# EAGLE design CC2-BufferPack-V1R0-21-May-2019 (EAGLE 5.10)

## Sheet 1 of 2
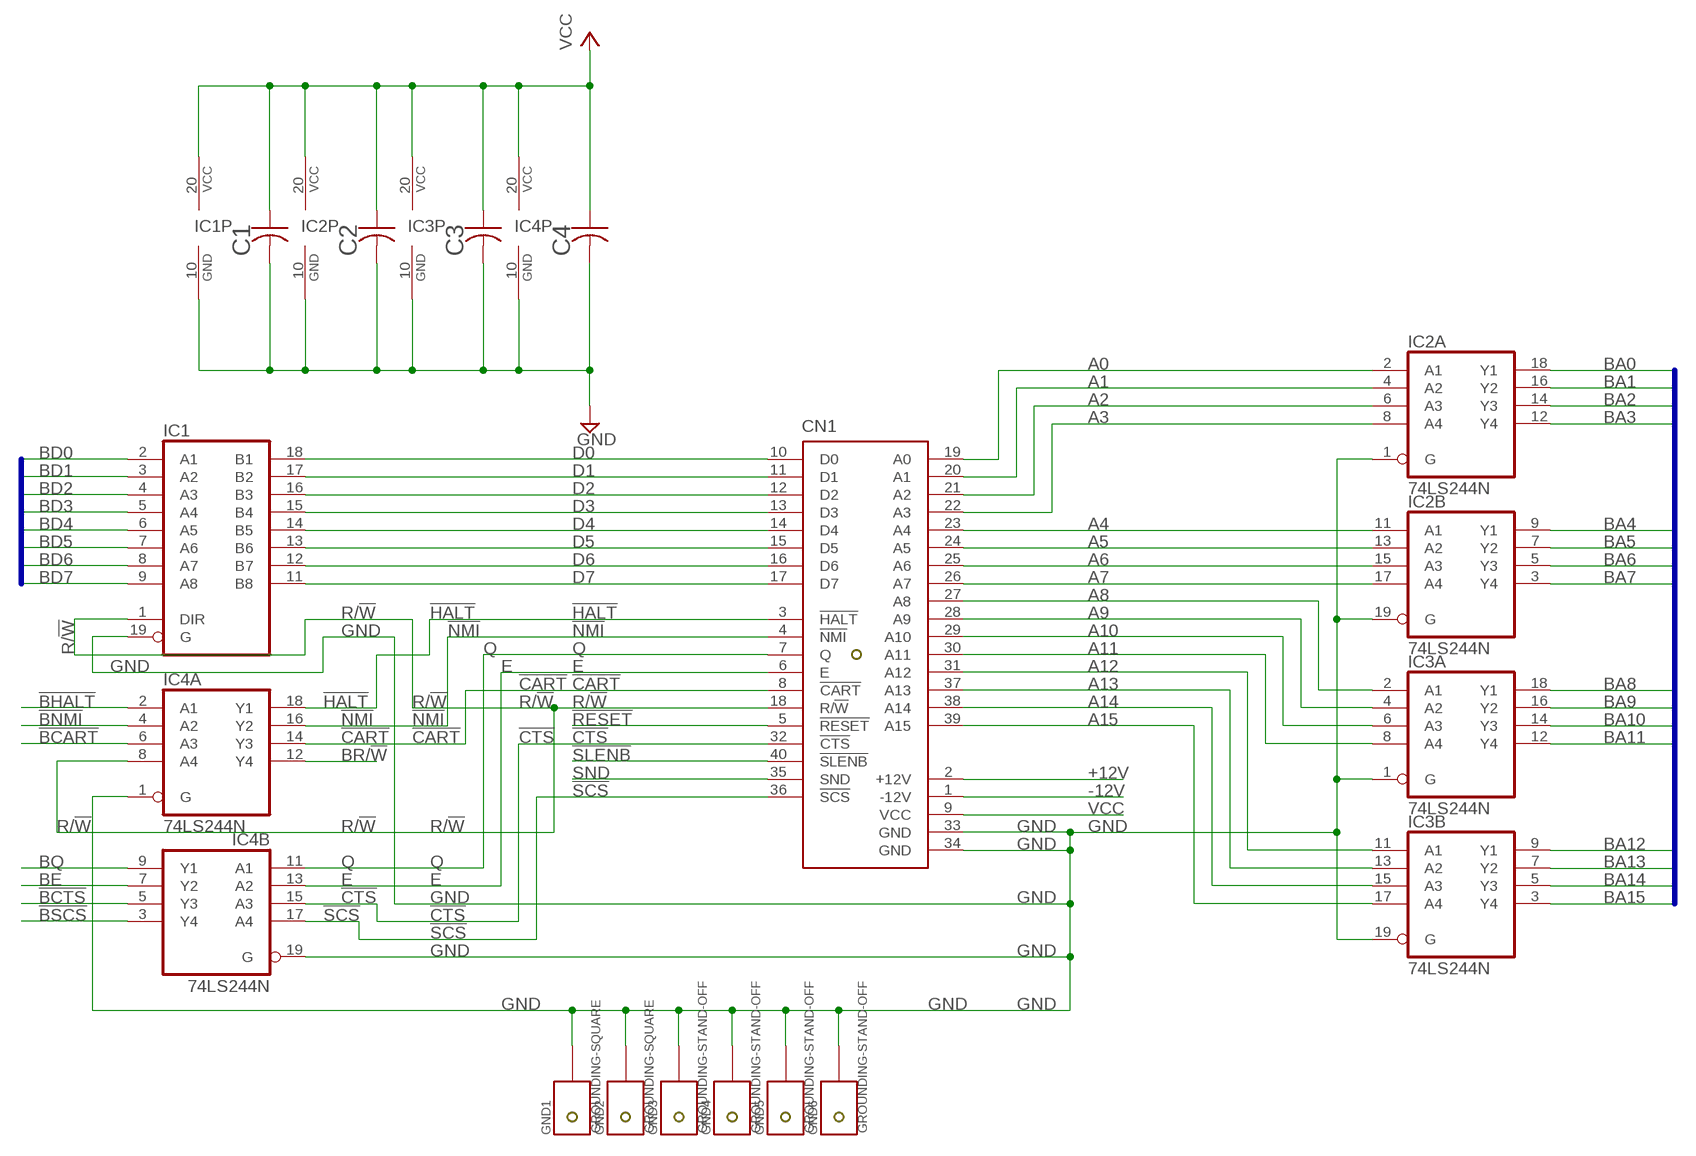
[diagram p0: schematic, sheet 1]

### Parts
C1  CAPACITOR-PTH1  [PTH1]
C2  CAPACITOR-PTH1  [PTH1]
C3  CAPACITOR-PTH1  [PTH1]
C4  CAPACITOR-PTH1  [PTH1]
CN1  COCO3-CARTRIDGE-PLUG-MEDIUM  [EDGE-CARD-PLUG-2X20-100-MEDIUM]
GND1  GROUNDING-SQUARE  [SQUARE]
GND2  GROUNDING-SQUARE  [SQUARE]
GND3  GROUNDING-STAND-OFF  [STAND-OFF]
GND4  GROUNDING-STAND-OFF  [STAND-OFF]
GND5  GROUNDING-STAND-OFF  [STAND-OFF]
GND6  GROUNDING-STAND-OFF  [STAND-OFF]
IC1  74LS245N  [DIL20-3-TOP]
IC2  74LS244N  [DIL20-3-TOP]
IC3  74LS244N  [DIL20-3-TOP]
IC4  74LS244N  [DIL20-3-TOP]

### Nets
!BCART: IC4.6(A:A3) ; also sheet 2
!BCTS: IC4.5(B:Y3) ; also sheet 2
!BHALT: IC4.2(A:A1) ; also sheet 2
!BNMI: IC4.4(A:A2) ; also sheet 2
!BSCS: IC4.3(B:Y4) ; also sheet 2
!CART: CN1.8(!CART) IC4.14(A:Y3)
!CTS: CN1.32(!CTS) IC4.15(B:A3)
!HALT: CN1.3(!HALT) IC4.18(A:Y1)
!NMI: CN1.4(!NMI) IC4.16(A:Y2)
!RESET: CN1.5(!RESET) ; also sheet 2
!SCS: CN1.36(!SCS) IC4.17(B:A4)
!SLENB: CN1.40(!SLENB) ; also sheet 2
+12V [power]: CN1.2(+12V) ; also sheet 2
-12V [power]: CN1.1(-12V) ; also sheet 2
A0: CN1.19(A0) IC2.2(A:A1)
A1: CN1.20(A1) IC2.4(A:A2)
A2: CN1.21(A2) IC2.6(A:A3)
A3: CN1.22(A3) IC2.8(A:A4)
A4: CN1.23(A4) IC2.11(B:A1)
A5: CN1.24(A5) IC2.13(B:A2)
A6: CN1.25(A6) IC2.15(B:A3)
A7: CN1.26(A7) IC2.17(B:A4)
A8: CN1.27(A8) IC3.2(A:A1)
A9: CN1.28(A9) IC3.4(A:A2)
A10: CN1.29(A10) IC3.6(A:A3)
A11: CN1.30(A11) IC3.8(A:A4)
A12: CN1.31(A12) IC3.11(B:A1)
A13: CN1.37(A13) IC3.13(B:A2)
A14: CN1.38(A14) IC3.15(B:A3)
A15: CN1.39(A15) IC3.17(B:A4)
BA0: IC2.18(A:Y1) ; also sheet 2
BA1: IC2.16(A:Y2) ; also sheet 2
BA2: IC2.14(A:Y3) ; also sheet 2
BA3: IC2.12(A:Y4) ; also sheet 2
BA4: IC2.9(B:Y1) ; also sheet 2
BA5: IC2.7(B:Y2) ; also sheet 2
BA6: IC2.5(B:Y3) ; also sheet 2
BA7: IC2.3(B:Y4) ; also sheet 2
BA8: IC3.18(A:Y1) ; also sheet 2
BA9: IC3.16(A:Y2) ; also sheet 2
BA10: IC3.14(A:Y3) ; also sheet 2
BA11: IC3.12(A:Y4) ; also sheet 2
BA12: IC3.9(B:Y1) ; also sheet 2
BA13: IC3.7(B:Y2) ; also sheet 2
BA14: IC3.5(B:Y3) ; also sheet 2
BA15: IC3.3(B:Y4) ; also sheet 2
BD0: IC1.2(A1) ; also sheet 2
BD1: IC1.3(A2) ; also sheet 2
BD2: IC1.4(A3) ; also sheet 2
BD3: IC1.5(A4) ; also sheet 2
BD4: IC1.6(A5) ; also sheet 2
BD5: IC1.7(A6) ; also sheet 2
BD6: IC1.8(A7) ; also sheet 2
BD7: IC1.9(A8) ; also sheet 2
BE: IC4.7(B:Y2) ; also sheet 2
BQ: IC4.9(B:Y1) ; also sheet 2
BR/!W: IC4.12(A:Y4) ; also sheet 2
D0: CN1.10(D0) IC1.18(B1)
D1: CN1.11(D1) IC1.17(B2)
D2: CN1.12(D2) IC1.16(B3)
D3: CN1.13(D3) IC1.15(B4)
D4: CN1.14(D4) IC1.14(B5)
D5: CN1.15(D5) IC1.13(B6)
D6: CN1.16(D6) IC1.12(B7)
D7: CN1.17(D7) IC1.11(B8)
E: CN1.6(E) IC4.13(B:A2)
GND [power]: C1.- C2.- C3.- C4.- CN1.33(GND) CN1.34(GND) GND1.GND GND2.GND GND3.GND GND4.GND GND5.GND GND6.GND IC1.10(GND) IC1.19(G) IC2.1(A:G) IC2.10(P:GND) IC2.19(B:G) IC3.1(A:G) IC3.10(P:GND) IC3.19(B:G) IC4.1(A:G) IC4.10(P:GND) IC4.19(B:G) ; also sheet 2
Q: CN1.7(Q) IC4.11(B:A1)
R/!W: CN1.18(R/!W) IC1.1(DIR) IC4.8(A:A4)
SND: CN1.35(SND) ; also sheet 2
VCC [power]: C1.+ C2.+ C3.+ C4.+ CN1.9(VCC) IC1.20(VCC) IC2.20(P:VCC) IC3.20(P:VCC) IC4.20(P:VCC) ; also sheet 2

### Buses
BD[0..7]
BA[0..15]

## Sheet 2 of 2
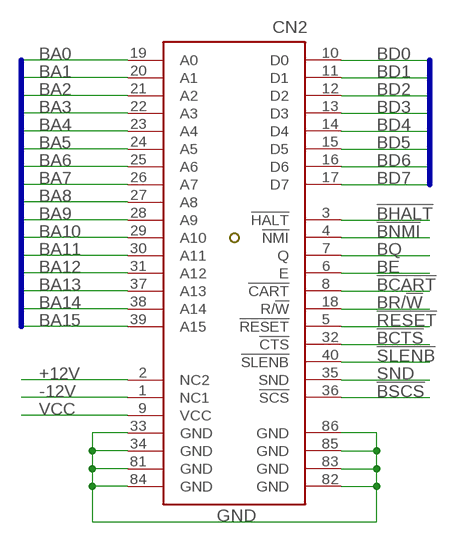
[diagram p1: schematic, sheet 2]

### Parts
CN2  COCO3-CARTRIDGE-SLOT-HEADER/SLOT-40  [HEADER/EDGE-CARD-RECEPTACLE-2X20-100-STRAIGHT-W/EARS]

### Nets
!BCART: CN2.8(!CART) ; also sheet 1
!BCTS: CN2.32(!CTS) ; also sheet 1
!BHALT: CN2.3(!HALT) ; also sheet 1
!BNMI: CN2.4(!NMI) ; also sheet 1
!BSCS: CN2.36(!SCS) ; also sheet 1
!RESET: CN2.5(!RESET) ; also sheet 1
!SLENB: CN2.40(!SLENB) ; also sheet 1
+12V [power]: CN2.2(NC2) ; also sheet 1
-12V [power]: CN2.1(NC1) ; also sheet 1
BA0: CN2.19(A0) ; also sheet 1
BA1: CN2.20(A1) ; also sheet 1
BA2: CN2.21(A2) ; also sheet 1
BA3: CN2.22(A3) ; also sheet 1
BA4: CN2.23(A4) ; also sheet 1
BA5: CN2.24(A5) ; also sheet 1
BA6: CN2.25(A6) ; also sheet 1
BA7: CN2.26(A7) ; also sheet 1
BA8: CN2.27(A8) ; also sheet 1
BA9: CN2.28(A9) ; also sheet 1
BA10: CN2.29(A10) ; also sheet 1
BA11: CN2.30(A11) ; also sheet 1
BA12: CN2.31(A12) ; also sheet 1
BA13: CN2.37(A13) ; also sheet 1
BA14: CN2.38(A14) ; also sheet 1
BA15: CN2.39(A15) ; also sheet 1
BD0: CN2.10(D0) ; also sheet 1
BD1: CN2.11(D1) ; also sheet 1
BD2: CN2.12(D2) ; also sheet 1
BD3: CN2.13(D3) ; also sheet 1
BD4: CN2.14(D4) ; also sheet 1
BD5: CN2.15(D5) ; also sheet 1
BD6: CN2.16(D6) ; also sheet 1
BD7: CN2.17(D7) ; also sheet 1
BE: CN2.6(E) ; also sheet 1
BQ: CN2.7(Q) ; also sheet 1
BR/!W: CN2.18(R/!W) ; also sheet 1
GND [power]: CN2.33(GND) CN2.34(GND) CN2.81(GND) CN2.82(GND) CN2.83(GND) CN2.84(GND) CN2.85(GND) CN2.86(GND) ; also sheet 1
SND: CN2.35(SND) ; also sheet 1
VCC [power]: CN2.9(VCC) ; also sheet 1

### Buses
BA[0..15]
BD[0..7]

## Library data of the parts
C1-C4 = CC2-BufferPack-V1R0-21-May-2019:CAPACITOR: NON-POLARIZED CAPACITOR grid 5mm
CN1 = CC2-BufferPack-V1R0-21-May-2019:COCO3-CARTRIDGE-PLUG: CoCo 3 Program Pak Cartridge Plug - http://www.GIMEchip.com/ Tandy Radio Shack TRS-80 Color Computer 3 Program Pak Cartridge Plug (Edge-Card) E.A.G.L.E. Library Part created by John Eric Turner & His Father - sales@gimechip.com <mailto:sales@gimechip.com?subject=Tandy Radio Shack TRS- 80 Color Computer 3 Program Pak Cartridge Plug (Edge-Card) E.A.G.L.E. Library Part> 40-Pin Edge-Card sharing the same pinout as the Program Pak Cartridge Edge-Card Connector. This library part has been designed to provide a 40-pin cartridge plug connector matching the CoCo's Edge-Card connector (Cartridge Slot). This library part is also useful with the Dragon and other CoCo clones. It is important to note that the CoCo 2 & 3 only provide +5V at the cartridge connector. The CoCo 1 provides +5V AND +/-12V at the cartridge connector. The Dragon provides only +5V and +12V at the cartridge connector. The table below lists all similarities and differences between these machines, relevant to the cartridge slot: PIN # TRS-80 "CoCo 1" Function Tano/Dragon Data "Dragon 32/64" Function TRS-80 "CoCo 2 & 3" Function 1 -12V +12V NC 2 +12V +12V NC 3 HALT* HALT* HALT* 4 NMI* NMI* NMI* 5 RESET* RESET* RESET* 6 E E E 7 Q Q Q 8 CART* CART* CART* 9 +5V +5V +5V 10 D0 D0 D0 11 D1 D1 D1 12 D2 D2 D2 13 D3 D3 D3 14 D4 D4 D4 15 D5 D5 D5 16 D6 D6 D6 17 D7 D7 D7 18 R/W* R/W* R/W* 19 A0 A0 A0 20 A1 A1 A1 21 A2 A2 A2 22 A3 A3 A3 23 A4 A4 A4 24 A5 A5 A5 25 A6 A6 A6 26 A7 A7 A7 27 A8 A8 A8 28 A9 A9 A9 29 A10 A10 A10 30 A11 A11 A11 31 A12 A12 A12 32 CTS* CSEL* CTS* 33 GND GND GND 34 GND GND GND 35 SND SND SND 36 SCS* P2* SCS* 37 A13 A13 A13 38 A14 A14 A14 39 A15 A15 A15 40 SLENB* DSD* SLENB*
CN2 = CC2-BufferPack-V1R0-21-May-2019:COCO3-CARTRIDGE-SLOT: CoCo 3 Program Pak Cartridge Slot HEADER/SLOT - http://www.GIMEchip.com/ Tandy Radio Shack TRS-80 Color Computer 3 Program Pak Cartridge Slot HEADER/SLOT E.A.G.L.E. Library Part created by John Eric Turner & His Father - sales@gimechip.com <mailto:sales@gimechip.com?subject=Tandy Radio Shack TRS- 80 Color Computer 3 Program Pak Cartridge Slot E.A.G.L.E. Library Part> 40-Pin Header and Slot sharing the same pinout as the Program Pak Cartridge Edge-Card Connector. This library part has been designed to provide a 40-pin cartridge slot connector matching the CoCo's Edge-Card connector (Cartridge Slot). This library part is also useful with the Dragon and other CoCo clones. It is important to note that the CoCo 2 & 3 only provide +5V at the cartridge connector. The CoCo 1 provides +5V AND +/-12V at the cartridge connector. The Dragon provides only +5V and +12V at the cartridge connector. The table below lists all similarities and differences between these machines, relevant to the cartridge slot: PIN # TRS-80 "CoCo 1" Function Tano/Dragon Data "Dragon 32/64" Function TRS-80 "CoCo 2 & 3" Function 1 -12V +12V NC 2 +12V +12V NC 3 HALT* HALT* HALT* 4 NMI* NMI* NMI* 5 RESET* RESET* RESET* 6 E E E 7 Q Q Q 8 CART* CART* CART* 9 +5V +5V +5V 10 D0 D0 D0 11 D1 D1 D1 12 D2 D2 D2 13 D3 D3 D3 14 D4 D4 D4 15 D5 D5 D5 16 D6 D6 D6 17 D7 D7 D7 18 R/W* R/W* R/W* 19 A0 A0 A0 20 A1 A1 A1 21 A2 A2 A2 22 A3 A3 A3 23 A4 A4 A4 24 A5 A5 A5 25 A6 A6 A6 26 A7 A7 A7 27 A8 A8 A8 28 A9 A9 A9 29 A10 A10 A10 30 A11 A11 A11 31 A12 A12 A12 32 CTS* CSEL* CTS* 33 GND GND GND 34 GND GND GND 35 SND SND SND 36 SCS* P2* SCS* 37 A13 A13 A13 38 A14 A14 A14 39 A15 A15 A15 40 SLENB* DSD* SLENB*
GND1-GND6 = CC2-BufferPack-V1R0-21-May-2019:GROUNDING
IC1 = CC2-BufferPack-V1R0-21-May-2019:74*245: Octal BUS TRANSCEIVER, 3-state
IC2-IC4 = CC2-BufferPack-V1R0-21-May-2019:74*244: Octal BUFFER and LINE DRIVER, 3-state

## Net classes
0 default: width 0.152 mm, clearance 0.152 mm
1 power: width 0.635 mm, clearance 0.152 mm

## Board
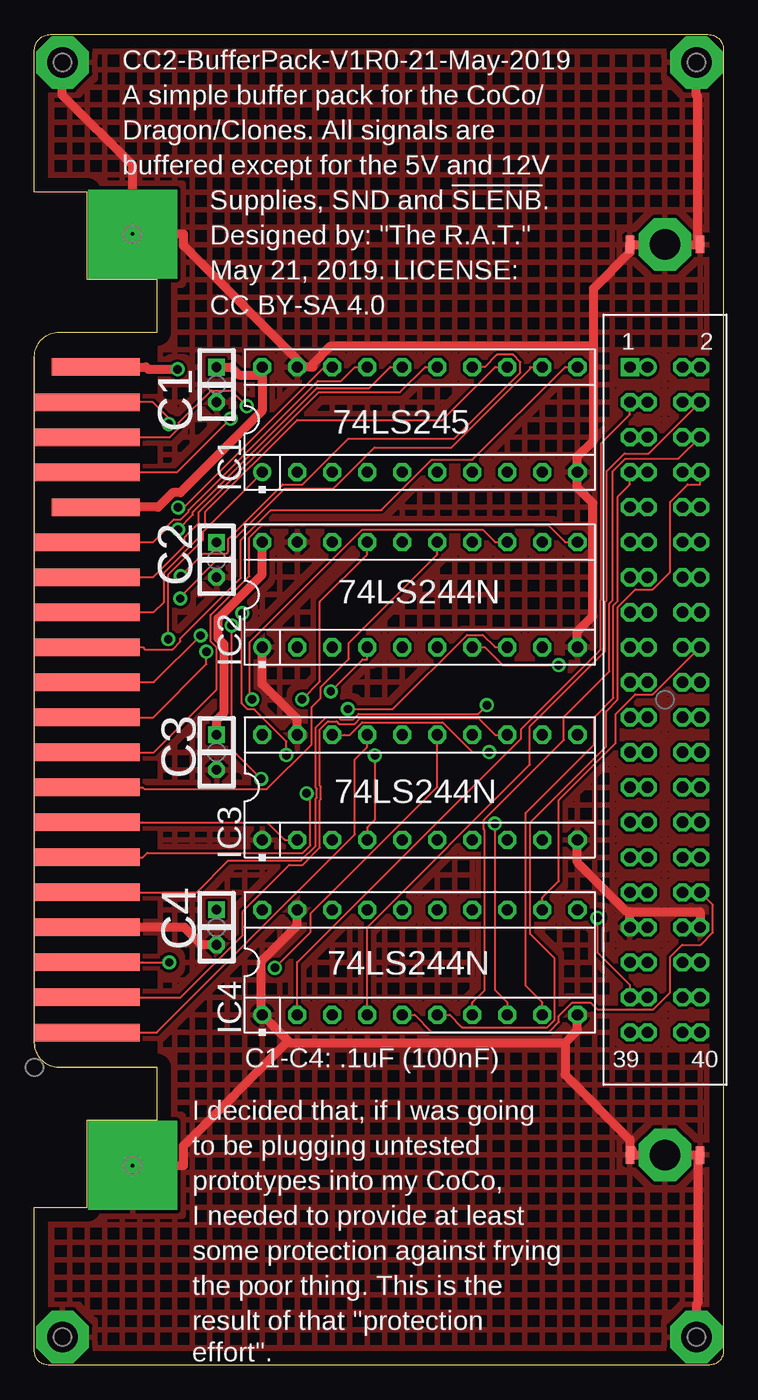
[diagram p2: board, top side]
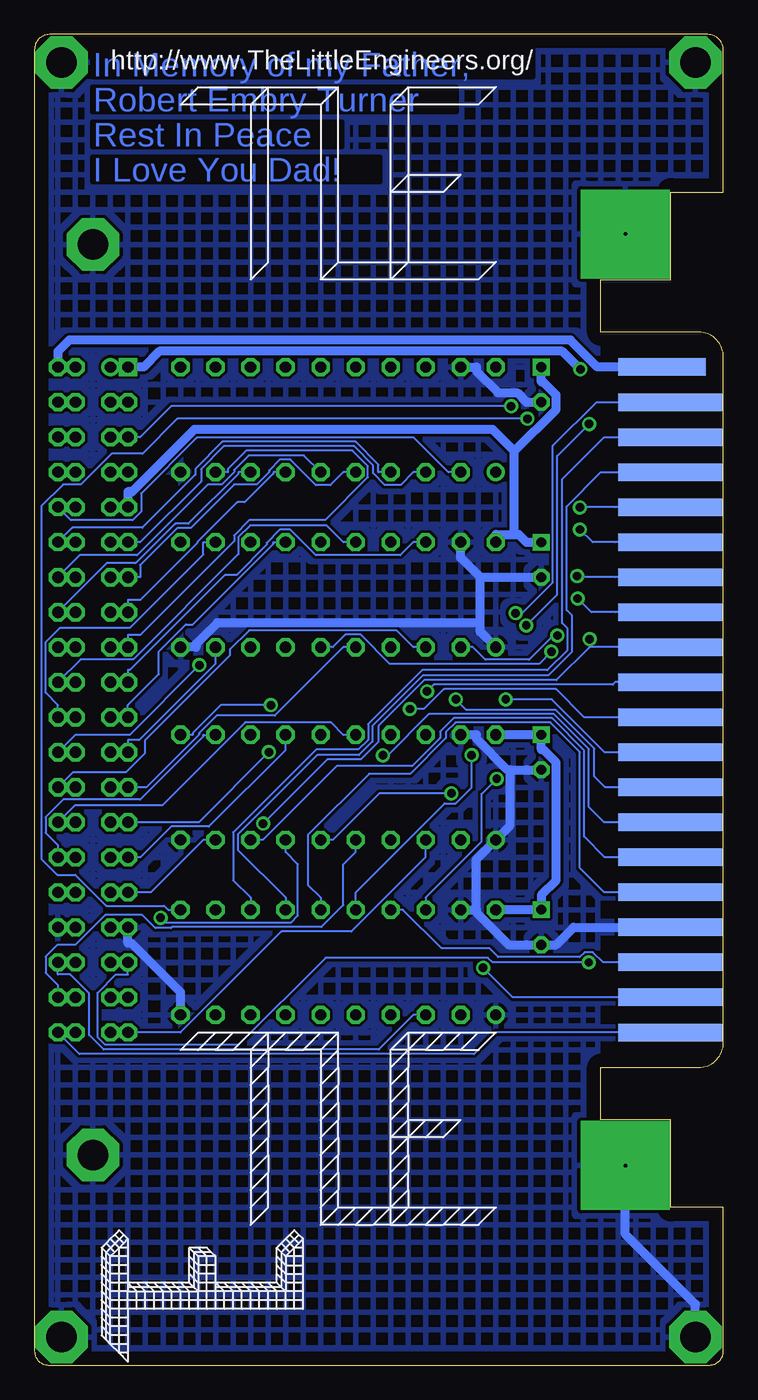
[diagram p3: board, bottom side, seen from below]

Size 49.96 x 96.52 mm. Coordinates in mm from the lower left corner, seen from the top.
Outline: 8.89,21.59 1.8,21.59 arc-90 0,23.39 0,73.13 arc-90 1.8,74.93 8.89,74.93 8.89,78.74 3.81,78.74 3.81,85.09 0,85.09 0,95.39 arc-90 1.13,96.52 48.87,96.52 arc-90 49.96,95.43 49.96,1 arc-90 48.96,0 1,0 arc-90 0,1 0,11.43 3.81,11.43 3.81,17.78 8.89,17.78 8.89,21.59
Copper layers (1*16): Top 0.035mm / dielectric 1.5mm / Bottom 0.035mm
Design rules "default": minimum track width 10mil, minimum drill 24mil, track to track 8mil, track to pad 8mil, pad to pad 8mil, via to via 8mil, smd to smd 8mil, copper to edge 40mil, drill to drill 8mil, minimum pad ring 10mil, minimum via ring 8mil, stop-mask expansion 4mil, vias tented up to drill 0mil, thermal gap 10mil

### Footprints (pad centres in the part's own frame; a part is rotated, then mirrored left to right if it is on the bottom)
PTH1 = drill 0.7 square: + -1.27,0 | drill 0.7 octagon: - 1.27,0
EDGE-CARD-PLUG-2X20-100-MEDIUM = smd 6.35 x 1.27: 1 4.445,50.8; 9 4.445,40.64 | smd 6.35 x 1.27 bottom: 2 4.445,50.8 | smd 7.62 x 1.27: 3 3.81,48.26; 5 3.81,45.72; 7 3.81,43.18; 11 3.81,38.1; 13 3.81,35.56; 15 3.81,33.02; 17 3.81,30.48; 19 3.81,27.94; 21 3.81,25.4; 23 3.81,22.86; 25 3.81,20.32; 27 3.81,17.78; 29 3.81,15.24; 31 3.81,12.7; 33 3.81,10.16; 35 3.81,7.62; 37 3.81,5.08; 39 3.81,2.54 | smd 7.62 x 1.27 bottom: 4 3.81,48.26; 6 3.81,45.72; 8 3.81,43.18; 10 3.81,40.64; 12 3.81,38.1; 14 3.81,35.56; 16 3.81,33.02; 18 3.81,30.48; 20 3.81,27.94; 22 3.81,25.4; 24 3.81,22.86; 26 3.81,20.32; 28 3.81,17.78; 30 3.81,15.24; 32 3.81,12.7; 34 3.81,10.16; 36 3.81,7.62; 38 3.81,5.08; 40 3.81,2.54
HEADER/EDGE-CARD-RECEPTACLE-2X20-100-STRAIGHT-W/EARS = drill 0.813 square: 1 -24.13,-2.54 | drill 0.813 octagon: 2 -24.13,2.54; 3 -21.59,-2.54; 4 -21.59,2.54; 5 -19.05,-2.54; 6 -19.05,2.54; 7 -16.51,-2.54; 8 -16.51,2.54; 9 -13.97,-2.54; 10 -13.97,2.54; 11 -11.43,-2.54; 12 -11.43,2.54; 13 -8.89,-2.54; 14 -8.89,2.54; 15 -6.35,-2.54; 16 -6.35,2.54; 17 -3.81,-2.54; 18 -3.81,2.54; 19 -1.27,-2.54; 20 -1.27,2.54; 21 1.27,-2.54; 22 1.27,2.54; 23 3.81,-2.54; 24 3.81,2.54; 25 6.35,-2.54; 26 6.35,2.54; 27 8.89,-2.54; 28 8.89,2.54; 29 11.43,-2.54; 30 11.43,2.54; 31 13.97,-2.54; 32 13.97,2.54; 33 16.51,-2.54; 34 16.51,2.54; 35 19.05,-2.54; 36 19.05,2.54; 37 21.59,-2.54; 38 21.59,2.54; 39 24.13,-2.54; 40 24.13,2.54; 42 -24.13,1.27; 43 -21.59,-1.27; 44 -21.59,1.27; 45 -19.05,-1.27; 46 -19.05,1.27; 47 -16.51,-1.27; 48 -16.51,1.27; 49 -13.97,-1.27; 50 -13.97,1.27; 51 -11.43,-1.27; 52 -11.43,1.27; 53 -8.89,-1.27; 54 -8.89,1.27; 55 -6.35,-1.27; 56 -6.35,1.27; 57 -3.81,-1.27; 58 -3.81,1.27; 59 -1.27,-1.27; 60 -1.27,1.27; 61 1.27,-1.27; 62 1.27,1.27; 63 3.81,-1.27; 64 3.81,1.27; 65 6.35,-1.27; 66 6.35,1.27; 67 8.89,-1.27; 68 8.89,1.27; 69 11.43,-1.27; 70 11.43,1.27; 71 13.97,-1.27; 72 13.97,1.27; 73 16.51,-1.27; 74 16.51,1.27; 75 19.05,-1.27; 76 19.05,1.27; 77 21.59,-1.27; 78 21.59,1.27; 79 24.13,-1.27; 80 24.13,1.27 | drill 0.813 round: 41 -24.13,-1.27 | drill 2.2 pad 3.81 octagon: 81 -33.02,0; 84 33.02,0 | smd 1.27 x 0.635: 82 -33.02,2.54; 83 -33.02,-2.54; 85 33.02,2.54; 86 33.02,-2.54
SQUARE = drill 0.254 pad 6.452 square: GND 0,0
STAND-OFF = drill 2.2 pad 3.81 octagon: GND 0,0
DIL20-3-TOP = drill 0.813 round: 1 -11.43,-3.81 | drill 0.813 octagon: 2 -8.89,-3.81; 3 -6.35,-3.81; 4 -3.81,-3.81; 5 -1.27,-3.81; 6 1.27,-3.81; 7 3.81,-3.81; 8 6.35,-3.81; 9 8.89,-3.81; 10 11.43,-3.81; 11 11.43,3.81; 12 8.89,3.81; 13 6.35,3.81; 14 3.81,3.81; 15 1.27,3.81; 16 -1.27,3.81; 17 -3.81,3.81; 18 -6.35,3.81; 19 -8.89,3.81; 20 -11.43,3.81

### Placement (x,y rotation side)
C1  13.21,71.12 270 top
C2  13.21,58.42 270 top
C3  13.21,44.45 270 top
C4  13.21,31.75 270 top
CN1  0,21.59 0 top
CN2  45.72,48.26 270 top
GND1  7.11,82.04 0 top
GND2  7.11,14.48 0 top
GND3  2.03,94.49 0 top
GND4  48.01,94.49 0 top
GND5  48.01,2.03 0 top
GND6  2.03,2.03 0 top
IC1  27.94,68.58 0 top
IC2  27.94,55.88 0 top
IC3  27.94,41.91 0 top
IC4  27.94,29.21 0 top
U$1  [TLE-LOGO-3]  29.21,83.82 0 bottom
U$2  [TLE-LOGO-4]  34.29,10.16 0 bottom
U$3  [TLE-LOGO-10]  30.48,0.25 90 bottom

### Tracks (layer width: path | path; a pad name or v marks a point on that pad's centre or on a via)
!BCART
  Top 0.152: CN2.8 48.26,63.88 47.37,63.88 46.1,62.61 46.1,57.53 44.83,56.26 43.57,56.26 42.29,54.98 42.29,48.26 41.45,47.42 41.45,44.86 35.94,39.35 35.94,31.27 37.72,29.49 37.72,25.03 37.19,24.51 30.99,24.51 30.1,25.4 IC4.6
!BCTS
  Top 0.152: CN2.32 49.19,33.36 49.19,31.37 48.3,30.48 46.99,30.48 46.1,29.59 46.1,27.02 44.87,25.78 40.82,25.78 40.31,26.29 38.99,26.29 38.03,25.32 38.03,24.88 37.32,24.18 28.78,24.18 27.56,25.4 IC4.5
!BHALT
  Top 0.152: CN2.3 43.18,68.96 41.09,66.87 41.09,55.5 41.07,55.48 41.07,51.91 35.29,46.13 35.29,45.46 19.05,29.22 19.05,26.29 IC4.2
!BNMI
  Top 0.152: CN2.4 44.54,66.13 42.78,66.13 41.49,64.83 41.49,55.47 41.38,55.36 41.38,51.78 35.93,46.33 35.93,43.56 24.13,31.76 24.13,26.29 IC4.4
!BSCS
  Bottom 0.152: CN2.36 48.26,28.32 47.37,28.32 45.99,26.94 45.99,23.95 44.94,22.9 24.98,22.9 22.48,25.4 IC4.3
!CART
  Bottom 0.152: CN1.8 8.9,64.77 11.38,62.29 11.38,54.76 10.98,54.37 10.98,51.77 12.72,50.03 21.8,50.03 25.46,46.36 25.46,45.23 26.45,44.24 29.47,44.24 35.21,38.51 35.21,37.37 31.75,33.91 IC4.14
!CTS
  Bottom 0.152: CN1.32 8.65,34.29 10.41,36.05 10.41,44.47 12.56,46.61 19.41,46.61 20.12,45.91 20.12,45.47 22.7,42.89 25.7,42.89 30.14,38.45 30.14,34.84 29.21,33.91 IC4.15
!HALT  (via drill 0.61 pad 1.02)
  Top 0.152: v16.44,42.52 14.3,44.66 v14.3,53.65 | v9.74,68.27 9.74,68.69 8.58,69.85 CN1.3
  Bottom 0.152: v9.74,68.27 12.06,65.95 12.06,55.89 v14.3,53.65 | IC4.18 21.59,33.91 17.53,37.97 17.53,41.43 v16.44,42.52
!NMI  (via drill 0.61 pad 1.02)
  Top 0.152: v18.26,44.24 18.26,45.24 15.95,47.56 15.48,47.56 15.04,47.99 15.04,54.51 v15.07,54.53
  Bottom 0.152: CN1.4 9.2,69.85 12.37,66.69 12.37,56.77 14.6,54.53 v15.07,54.53 | v18.26,44.24 18.26,41.9 19.43,40.74 20.21,40.74 26.67,34.28 IC4.16
!RESET  (via drill 0.61 pad 1.02)
  Top 0.152: CN1.5 9.82,67.31 10.48,67.97 10.48,68.35 12.82,70.7 14.25,70.7 v15.4,69.54
  Bottom 0.152: v15.4,69.54 40.06,69.54 42.29,67.31 CN2.5
!SCS
  Bottom 0.152: 8.73,29.21 9.46,29.95 10.07,29.95 10.42,29.6 16.34,29.6 16.96,30.22 20.44,30.22 23.24,33.02 IC4.17 | 8.73,29.21 | 8.73,29.21 7.85,29.21 CN1.36
!SLENB
  Bottom 0.152: CN2.40 46.7,22.57 18.09,22.57 16.52,24.13 CN1.40
+12V
  Bottom 0.635: CN2.2 48.26,73.52 47.43,74.36 11.1,74.36 9.13,72.39 CN1.2
-12V  (via drill 0.61 pad 1.02)
  Top 0.635: v10.37,72.23 8.25,72.23 8.09,72.39 CN1.1
  Bottom 0.635: v10.37,72.23 11.69,73.55 40.89,73.55 42.05,72.39 CN2.1
A0  (via drill 0.61 pad 1.02)
  Top 0.152: CN1.19 8.65,49.53 v12.04,52.92
  Bottom 0.152: v12.04,52.92 12.35,52.92 14.09,51.17 17.26,51.17 18.16,52.07 IC2.2
A1  (via drill 0.61 pad 1.02)
  Top 0.152: IC2.4 24.13,51.18 23.8,51.18 v21.48,48.86
  Bottom 0.152: CN1.20 7.85,49.53 8.03,49.35 20.99,49.35 v21.48,48.86
A2  (via drill 0.61 pad 1.02)
  Top 0.152: CN1.21 8.62,46.99 12.47,50.85 v12.47,51.75
  Bottom 0.152: v12.47,51.75 13.35,50.87 24.19,50.87 26.3,52.98 27.41,52.98 28.32,52.07 IC2.6
A3  (via drill 0.61 pad 1.02)
  Top 0.152: v22.73,47.59 25.99,47.59 31.37,52.97 32.5,52.97 33.4,52.07 IC2.8
  Bottom 0.152: CN1.22 10.09,46.99 12.13,49.03 20.27,49.03 21.71,47.59 v22.73,47.59
A4
  Top 0.152: CN1.23 8.65,44.45 13.21,49.01 13.21,52.05 12.78,52.48 12.78,54.42 15.57,57.22 15.57,60.03 16.47,60.92 37.25,60.92 38.48,59.69 IC2.11
A5  (via drill 0.61 pad 1.02)
  Top 0.152: v15.78,48.29 15.62,48.45 15.62,52.46 23.75,60.59 32.5,60.59 33.4,59.69 IC2.13
  Bottom 0.152: CN1.24 8.59,44.45 12.44,48.29 v15.78,48.29
A6
  Top 0.152: CN1.25 7.85,41.91 7.98,41.78 16.85,41.78 20.09,45.03 20.09,47.72 20.75,48.38 20.75,49.17 22.8,51.22 22.8,52.39 29.21,58.8 IC2.15
A7  (via drill 0.61 pad 1.02)
  Top 0.152: v19.4,48.29 20.7,49.59 20.7,55.37 24.13,58.8 IC2.17
  Bottom 0.152: CN1.26 8.58,41.91 9.37,42.7 9.37,44.72 12.18,47.53 18.64,47.53 v19.4,48.29
A8
  Top 0.152: CN1.27 7.85,39.37 16.89,39.37 18.16,38.1 IC3.2
A9  (via drill 0.61 pad 1.02)
  Top 0.152: IC3.4 24.13,38.99 24.69,39.55 v24.69,44.23
  Bottom 0.152: v24.69,44.23 24.35,44.23 21.36,47.22 12.3,47.22 9.75,44.67 9.75,40.48 8.65,39.37 CN1.28
A10  (via drill 0.61 pad 1.02)
  Top 0.152: CN1.29 7.85,36.83 8.18,37.16 19.46,37.16 20,37.71 20,41.21 v19.73,41.47
  Bottom 0.152: IC3.6 28.32,38.1 24.95,41.47 v19.73,41.47
A11
  Bottom 0.152: IC3.8 33.4,38.1 28.05,43.45 22.57,43.45 20.54,45.49 20.54,45.94 19.56,46.92 12.43,46.92 10.1,44.59 10.1,38.34 8.59,36.83 CN1.30
A12  (via drill 0.61 pad 1.02)
  Top 0.152: CN1.31 11.75,34.29 14.06,36.59 19.32,36.59 20.4,37.67 20.4,41.09 20.47,41.17 20.47,41.81 20.4,41.89 20.4,46.24 21.15,46.99 22.03,46.99 22.2,46.82 23.1,46.82 23.51,47.23 32.17,47.23 v32.81,47.87
  Bottom 0.152: v32.81,47.87 36.46,47.87 38.48,45.85 38.48,45.72 IC3.11
A13
  Top 0.152: CN1.37 10.62,26.67 15.1,31.15 15.1,32.9 18.48,36.29 19.44,36.29 20.7,37.55 20.7,40.97 20.78,41.04 20.78,41.94 20.7,42.01 20.7,46.11 21.27,46.69 21.91,46.69 22.07,46.52 23.23,46.52 23.64,46.92 32.2,46.92 33.4,45.72 IC3.13
A14  (via drill 0.61 pad 1.02)
  Top 0.152: IC3.15 29.21,41.92 20.03,32.74 20.03,31.41 v17.43,28.81
  Bottom 0.152: v17.43,28.81 15.29,26.67 CN1.38
A15
  Top 0.152: IC3.17 24.13,44.83 23.24,43.94 23.24,38.49 8.88,24.13 CN1.39
BA0
  Bottom 0.152: CN2.19 43.18,50.42 43.05,50.42 36.15,57.32 35.31,57.32 33.12,59.5 33.12,59.64 32.16,60.6 31.41,60.6 29.55,58.74 23.43,58.74 22.48,59.69 IC2.18
BA1
  Bottom 0.152: CN2.20 46.61,51.18 42.81,51.18 35.18,58.81 35.18,60.06 34.33,60.91 28.78,60.91 27.56,59.69 IC2.16
BA2
  Bottom 0.152: CN2.21 43.18,47.88 40.95,50.11 40.95,51.76 38.98,53.72 38.47,53.72 32.64,59.55 32.64,59.69 IC2.14
BA3
  Bottom 0.152: CN2.22 48.26,47.88 49.15,48.77 49.15,52.44 48.09,53.5 43.02,53.5 37.72,58.8 37.72,59.69 IC2.12
BA4
  Bottom 0.152: CN2.23 43.18,45.34 42.36,45.34 36.83,50.87 36.83,51.18 IC2.9
BA5  (via drill 0.61 pad 1.02)
  Top 0.152: v38,50.77 33.94,50.77 32.64,52.07 IC2.7
  Bottom 0.152: v38,50.77 43.05,45.72 46.99,45.72 CN2.24
BA6
  Bottom 0.152: CN2.25 41.85,41.91 38.02,45.73 38.02,45.85 36.76,47.11 32.52,47.11 27.56,52.07 IC2.5
BA7
  Bottom 0.152: CN2.26 47.18,42.99 43.32,42.99 41.95,44.37 41.95,45.32 35.8,51.47 35.8,51.89 34.4,53.28 23.69,53.28 22.48,52.07 IC2.3
BA8  (via drill 0.61 pad 1.02)
  Top 0.152: v32.97,44.47 31.75,44.47 29.59,46.62 23.76,46.62 22.86,45.72 22.48,45.72 IC3.18
  Bottom 0.152: CN2.27 38.06,39.37 v32.97,44.47
BA9
  Bottom 0.152: IC3.16 27.56,45.72 28.45,46.62 34.68,46.62 40.7,40.59 47.03,40.59 CN2.28
BA10
  Bottom 0.152: CN2.29 42.29,36.83 40.06,39.06 37.32,39.06 31.75,44.63 IC3.14
BA11
  Bottom 0.152: CN2.30 48.26,37.72 49.15,38.61 49.15,39.75 47.88,41.02 42.31,41.02 37.72,45.61 37.72,45.72 IC3.12
BA12
  Bottom 0.152: IC3.9 37.72,38.1 41.53,34.29 CN2.31
BA13  (via drill 0.61 pad 1.02)
  Top 0.152: v40.82,32.44 40.82,29.92 43.18,27.56 CN2.37 | v40.82,32.44
  Bottom 0.152: v40.82,32.44 40.46,32.08 31.39,32.08 30.86,32.61 30.86,36.31 31.75,37.21 IC3.7
BA14
  Bottom 0.152: CN2.38 48.26,27.56 49.15,28.45 49.15,29.63 48.3,30.48 47,30.48 44.83,32.66 42.16,32.66 41.19,31.69 40.06,31.69 39.98,31.78 29.15,31.78 27.56,33.37 27.56,36.32 26.67,37.21 IC3.5
BA15
  Bottom 0.152: IC3.3 21.59,36.84 26.98,31.45 32.06,31.45 39.38,24.13 CN2.39
BD0
  Bottom 0.152: IC1.2 19.94,64.77 22.45,67.28 38.19,67.28 42.23,63.23 42.23,61.9 42.85,61.29 47.32,61.29 CN2.10
BD1
  Bottom 0.152: CN2.11 42.29,59.69 37.88,64.1 37.88,64.99 36.23,66.64 26.78,66.64 25.4,65.26 25.4,64.69 24.55,63.85 23.4,63.85 22.48,64.77 IC1.3
BD2
  Bottom 0.152: CN2.12 47.21,60.74 42.13,60.74 38.29,64.58 38.29,65.01 36.33,66.97 26.68,66.97 25.02,65.31 25.02,64.77 IC1.4
BD3
  Bottom 0.152: CN2.13 42.29,57.15 42.29,58.04 39.61,60.72 38.63,60.72 35.48,63.88 33.85,63.88 32.94,64.79 32.94,64.9 32.16,65.68 31.4,65.68 29.55,63.83 28.5,63.83 27.56,64.77 IC1.5
BD4
  Bottom 0.152: CN2.14 46.67,58.74 42.52,58.74 37.38,63.88 36.37,63.88 35.48,64.77 35.48,64.93 34.43,65.99 30.43,65.99 IC1.6
BD5
  Bottom 0.152: CN2.15 43.18,55.5 42.29,55.5 38.15,59.64 38.15,59.69 35.26,62.59 34.72,62.59 32.64,64.66 32.64,64.77 IC1.7
BD6
  Bottom 0.152: CN2.16 44.71,58.16 42.62,58.16 39.75,61.03 38.8,61.03 35.18,64.64 35.18,64.77 IC1.8
BD7
  Bottom 0.152: CN2.17 43.18,52.96 42.29,52.96 35.48,59.77 35.48,60.19 34.37,61.3 28.88,61.3 25.78,64.4 25.78,65.21 26.91,66.34 34.6,66.34 35.94,64.99 35.94,64.77 IC1.9
BE
  Top 0.152: CN2.6 46.7,65.75 42.84,65.75 41.93,64.84 41.93,55.48 41.68,55.23 41.68,50.31 38.39,47.02 38.39,45.33 32.59,39.53 32.59,38.86 32.65,38.81 32.65,27.19 31.75,26.29 IC4.7
BQ
  Top 0.152: CN2.7 43.18,63.88 42.29,62.99 42.29,55.41 41.99,55.1 41.99,48.39 40.57,46.98 40.57,45.02 35.61,40.05 35.61,27.51 36.83,26.29 IC4.9
BR/!W
  Top 0.152: CN2.18 44.83,48.64 43.56,48.64 42.14,47.22 42.14,45.11 38.02,41 38.02,35.1 36.83,33.91 IC4.12
D0  (via drill 0.61 pad 1.02)
  Top 0.152: IC1.18 21,72.39 10.82,62.21 v10.41,62.21
  Bottom 0.152: v10.41,62.21 10.39,62.23 7.85,62.23 CN1.10
D1
  Top 0.152: CN1.11 8.6,59.69 9.67,60.76 9.67,60.91 10.11,61.34 10.59,61.34 11.18,61.93 11.18,62.02 20.53,71.37 22.23,71.37 22.23,71.38 23.24,72.39 IC1.17
D2  (via drill 0.61 pad 1.02)
  Top 0.152: v10.41,60.61 11.48,61.68 11.48,61.88 20.47,70.87 24.26,70.87 25.78,72.39 IC1.16
  Bottom 0.152: v10.41,60.61 9.49,59.69 7.85,59.69 CN1.12
D3
  Top 0.152: IC1.15 28.32,72.39 26.5,70.57 20.62,70.57 11.93,61.88 11.93,61.09 10.91,60.07 10.91,59.46 8.61,57.15 CN1.13
D4  (via drill 0.61 pad 1.02)
  Top 0.152: v10.62,57.23 12.24,58.86 13.91,58.86 14.04,58.99 14.04,59.92 18,63.88 19.42,63.88 22.74,67.2 30.43,67.2 35.23,72 35.23,72.75 34.7,73.28 33.53,73.28 32.64,72.39 IC1.14
  Bottom 0.152: v10.62,57.23 10.54,57.15 7.85,57.15 CN1.14
D5
  Top 0.152: CN1.15 8.64,54.61 9.4,55.36 9.4,57.49 11.93,60.02 11.93,60.58 12.39,61.04 12.39,61.91 19.05,68.56 29.57,68.56 33.4,72.39 IC1.13
D6  (via drill 0.61 pad 1.02)
  Top 0.152: v10.57,55.6 10.57,55.72 13.12,58.27 13.82,58.27 14.39,58.84 14.39,59.83 18.14,63.58 21.65,63.58 24.64,66.56 30.22,66.56 35.94,72.28 35.94,72.39 IC1.12
  Bottom 0.152: v10.57,55.6 9.58,54.61 7.85,54.61 CN1.16
D7
  Top 0.152: CN1.17 7.85,52.07 8,51.92 10.02,51.92 10.59,52.49 10.59,52.71 14.96,57.09 14.96,59.85 17.12,62 25.16,62 28.82,65.67 31.76,65.67 38.48,72.39 IC1.11
E
  Bottom 0.152: CN1.6 8.65,67.31 11.7,64.26 11.7,53.81 11.3,53.42 11.3,51.87 12.78,50.4 21.85,50.4 25.77,46.48 25.77,45.36 26.47,44.66 29.53,44.66 35.55,38.64 35.55,35.17 34.29,33.91 IC4.13
GND
  Top 0.635: 18.4,23.51 18.54,23.37 38.47,23.37 | 19.61,72.39 10.81,81.2 10.81,82.04 GND1.GND 7.11,87.03 2.03,92.11 GND3.GND | 19.61,72.39 20.18,72.39 20.18,72.62 21.45,73.9 40.54,73.9 | 19.61,72.39 IC1.19 | 40.54,73.9 40.54,67.07 39.37,65.9 IC1.10 39.37,63.64 40.5,62.51 40.5,54.33 39.37,53.2 IC2.10 | 40.54,73.9 40.54,78.09 43.18,80.73 43.18,81 | IC2.1 16.51,49.39 19.05,46.85 IC3.19 | IC3.10 39.37,36.47 42.95,32.88 43.18,32.88 | CN2.34 48.26,32.88 43.18,32.88 | CN2.33 43.18,32.88 | GND2.GND 10.81,14.48 10.81,15.92 18.4,23.51 | 18.4,23.51 IC4.1 16.45,25.45 16.45,29.29 19.05,31.89 IC4.19 | 38.47,23.37 39.37,24.27 IC4.10 | 38.47,23.37 38.47,21.05 43.18,16.34 43.18,15.79 | C4.- 12.13,30.48 10.86,31.75 CN1.34 | 43.18,15.79 43.34,15.63 43.34,15.24 CN2.84 46.91,15.24 48.09,15.24 | 43.18,15.79 CN2.86 | 43.18,81 43.34,81.17 43.34,81.28 CN2.81 48.09,81.28 | 43.18,81 CN2.83 | 48.09,81.28 CN2.82 | 48.09,81.28 48.09,92.02 48.01,92.11 GND4.GND | 48.09,15.24 CN2.85 | 48.09,15.24 48.09,4.5 48.01,4.41 GND5.GND
  Bottom 0.635: 17.64,53.83 17.64,57.15 | IC2.1 17.64,53.2 17.64,53.83 | 17.64,53.83 36.71,53.83 38.24,52.3 38.24,52.07 IC2.10 | 15.46,43.18 14.28,43.18 C3.- | 15.46,43.18 15.66,43.18 17.92,45.44 17.92,45.72 IC3.19 | 15.46,43.18 15.46,39.15 IC3.1 17.92,36.69 17.92,33.02 | 17.64,57.15 19.05,58.56 IC2.19 | 17.64,57.15 14.28,57.15 C2.- | GND6.GND 2.03,4.41 7.11,9.49 GND2.GND | C1.- 14.28,69.85 14.96,70.53 16.34,70.53 17.92,72.11 17.92,72.39 IC1.19 | 17.92,33.02 17.92,32.83 15.57,30.48 14.28,30.48 C4.- 12.13,30.48 10.86,31.75 CN1.34 | IC4.10 39.37,27.04 42.95,30.62 43.18,30.62 CN2.33 | IC4.19 17.92,33.02
  pour Bottom (hatched): 0,96.52 49.78,96.52 49.78,0.25 0,0.25
  pour Top (hatched): 0,96.52 50.04,96.52 50.04,0 0,0
Q  (via drill 0.61 pad 1.02)
  Top 0.152: v14.22,68.65 10.34,64.77 CN1.7
  Bottom 0.152: IC4.11 40.26,33.02 40.55,33.31 44.76,33.31 47,35.56 48.31,35.56 49.47,36.72 49.47,62.3 47.89,63.88 46.6,63.88 44.36,66.12 42.13,66.12 39.59,68.65 v14.22,68.65
R/!W  (via drill 0.61 pad 1.02)
  Top 0.152: IC4.8 34.29,26.29 33.38,27.2 v33.38,39.28 | v9.7,52.65 9.7,57.36 12.23,59.89 12.23,60.45 16.51,64.73 IC1.1
  Bottom 0.152: v33.38,39.28 28.72,43.94 26.29,43.94 25.02,45.21 25.02,46.37 21.7,49.68 12.12,49.68 9.7,52.1 | 9.7,52.1 v9.7,52.65 | CN1.18 9.67,52.07 9.7,52.1
SND  (via drill 0.61 pad 1.02)
  Top 0.152: CN1.35 7.85,29.21 v9.77,29.21
  Bottom 0.152: CN2.35 43.18,28.32 44.07,28.32 45.38,27.01 45.38,23.77 44.84,23.23 35.18,23.23 28.86,29.55 17.08,29.55 16.73,29.21 v9.77,29.21
VCC
  Top 0.635: CN1.9 8.97,62.23 10.03,63.28 10.57,63.28 16.51,69.22 16.51,71.26 16.51,71.83 | C1.+ 14.28,72.39 14.85,71.83 16.51,71.83 | 16.51,71.83 IC1.20 | IC2.20 16.51,58.56 16.51,57.35 13.32,54.17 13.32,52.71 13.76,52.28 13.76,47.34 13.21,46.79 C3.+
  Bottom 0.635: 15.16,60.26 14.85,60.26 14.28,59.69 C2.+ | 15.16,60.26 16.51,60.26 IC2.20 | 15.16,60.26 15.16,66.29 | 15.16,66.29 16.74,67.86 38.37,67.86 42.88,63.36 43.18,63.36 CN2.9 | 15.16,66.29 12.13,69.32 12.13,70.38 13.07,71.32 13.21,71.32 C1.+ | IC3.20 14.28,45.72 C3.+ 13.21,44.65 13.07,44.65 12.13,43.71 12.13,35.17 13.21,34.09 C4.+ IC4.20

### Text on the board
Bottom: In Memory of my Father, | Robert Embry Turner | Rest In Peace | I Love You Dad!
tPlace: CC2-BufferPack-V1R0-21-May-2019 | A simple buffer pack for the CoCo/ | Dragon/Clones. All signals are | buffered except for the 5V and 12V | Supplies, SND and !SLENB!. | Designed by: "The R.A.T." | May 21, 2019. LICENSE: | CC BY-SA 4.0 | 74LS245 | C1-C4: .1uF (100nF) | I decided that, if I was going | to be plugging untested | prototypes into my CoCo, | I needed to provide at least | some protection against frying | the poor thing. This is the | result of that "protection | effort".
bPlace: http://www.TheLittleEngineers.org/